# Altium schematic sheet CLRC66302HN, 151.SchDoc
size A; SheetNumber: 3; SheetTotal: 10
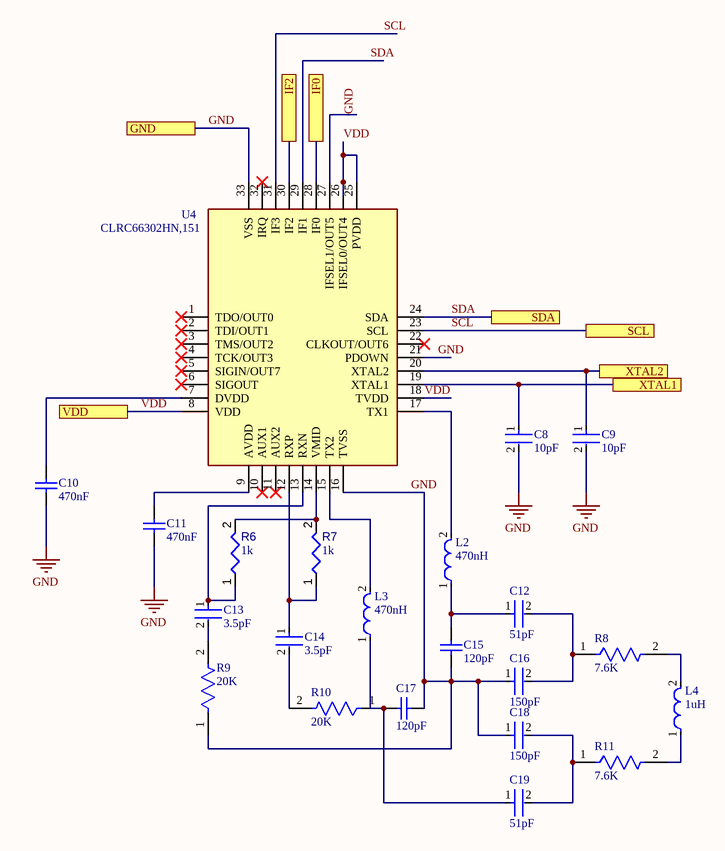
[diagram p0: CLRC66302HN, 151.SchDoc]

## Parts
C8  10pF  [FP-GRM033-0_03-IPC_A]
C9  10pF  [FP-GRM033-0_03-IPC_A]
C10  470nF  [CAPC1005X55X25LL05T10]
C11  470nF  [CAPC1005X55X25LL05T10]
C12  51pF  [FP-GRM033-0_03-IPC_B]
C13  3.5pF  [FP-CL1012-IPC_C]
C14  3.5pF  [FP-CL1012-IPC_C]
C15  120pF  [CAPC1005X55X25ML05T10]
C16  150pF  [FP-GRM033-0_03-MFG]
C17  120pF  [CAPC1005X55X25ML05T10]
C18  150pF  [FP-GRM033-0_03-MFG]
C19  51pF  [FP-GRM033-0_03-IPC_B]
L2  470nH  [FP-MLZ1005-MFG]
L3  470nH  [FP-MLZ1005-MFG]
L4  1uH  [FP-MLP1005D-MFG]
R6  value 1k  [RESC0402(1005)_L]  (hidden comment: 1KR2J)
R7  value 1k  [RESC0402(1005)_L]  (hidden comment: 1KR2J)
R8  7.6K  [FP-AC0402-IPC_B]
R9  20K  [FP-ERJ2RK-MFG]
R10  20K  [FP-ERJ2RK-MFG]
R11  7.6K  [FP-AC0402-IPC_B]
U4  CLRC66302HN,151  [QFN50P500X500X100-33N-D]

## Ports
GND (see mainsheet[1B], MAXREFDES117[2C], temp[2B]), IF0 (see mainsheet[2B]), IF2 (see mainsheet[2B]), SCL (see mainsheet[2A], ESP32-C3-MINI-1U-H4[2C], MAXREFDES117[1B], temp[1B]), SDA (see mainsheet[2A], ESP32-C3-MINI-1U-H4[2C], MAXREFDES117[1B], temp[1B]), VDD (see mainsheet[1B], NHD-1.27-12896UGC3[1B]), XTAL1 (see mainsheet[2B], ESP32-C3-MINI-1U-H4[2B]), XTAL2 (see mainsheet[2B], ESP32-C3-MINI-1U-H4[2B])

## Nets
GND: C8.2 C9.2 C10.1 C11.1 C15.1 C16.1 C17.2 C18.1 R9.1 U4.16(TVSS) U4.21(PDOWN) U4.27(IFSEL1/OUT5) U4.33(VSS) ; port GND
IF0: U4.28(IF0) ; port IF0
IF2: U4.30(IF2) ; port IF2
SCL: U4.23(SCL) U4.31(IF3) ; port SCL
SDA: U4.24(SDA) U4.29(IF1) ; port SDA
VDD: U4.8(VDD) U4.18(TVDD) U4.25(PVDD) U4.26(IFSEL0/OUT4) ; port VDD
XTAL1: C8.1 U4.19(XTAL1) ; port XTAL1
XTAL2: C9.1 U4.20(XTAL2) ; port XTAL2
NetC10_2: C10.2 U4.7(DVDD)
NetC11_2: C11.2 U4.9(AVDD)
NetC12_1: C12.1 C15.2 L2.1
NetC12_2: C12.2 C16.2 R8.1
NetC13_1: C13.1 R6.1 U4.13(RXN)
NetC13_2: C13.2 R9.2
NetC14_1: C14.1 R7.1 U4.12(RXP)
NetC14_2: C14.2 R10.2
NetC17_1: C17.1 C19.1 L3.1 R10.1
NetC18_2: C18.2 C19.2 R11.1
NetL2_2: L2.2 U4.17(TX1)
NetL3_2: L3.2 U4.15(TX2)
NetL4_1: L4.1 R11.2
NetL4_2: L4.2 R8.2
NetR6_2: R6.2 R7.2 U4.14(VMID)

Not connected (* = marked no-connect by the designer): U4 1(TDO/OUT0)* 2(TDI/OUT1)* 3(TMS/OUT2)* 4(TCK/OUT3)* 5(SIGIN/OUT7)* 6(SIGOUT)* 10(AUX1)* 11(AUX2)* 22(CLKOUT/OUT6)* 32(IRQ)*

## Library data of the parts
C8 C9 = CMP-2010-01302-2: Chip Multilayer Ceramic Capacitors for General Purpose, 0201, 10pF, C0G, 30ppm/°C, 5%, 25V; Length: 0.024inch; Voltage Rating: 25V; Packaging: Tape and Reel; Max Operating Temperature: 125°C; Mount: Surface Mount; Capacitance: 10pF; Tolerance: 5%; Series: GRM; Case Code (Metric): 0603; Package Quantity: 1; Voltage Rating (DC): 25V; Depth: 0.3mm; Min Operating Temperature: -55°C; Width: 0.012inch; Thickness: 0.013inch; Termination: SMD/SMT; Lead Free: Lead Free; Case/Package: 0201; Case Code (Imperial): 0201; Dielectric: C0G; REACH SVHC: No SVHC
C10 C11 = CMP-2008-04548-1: Manufacturer: Murata; Part Number: GRM155R60J474KE19D
C12 C19 = CMP-2010-01140-2: Chip Multilayer Ceramic Capacitors for General Purpose, 0201, 51pF, C0G, 30ppm/°C, 2%, 50V; Packaging: Tape and Reel; Case Code (Metric): 0603; Tolerance: 2%; Case/Package: 0201; Width: 0.012inch; Voltage Rating: 50V; Min Operating Temperature: -55°C; Mount: Surface Mount; Package Quantity: 15000; Case Code (Imperial): 0201; Length: 0.024inch; Thickness: 0.013inch; Capacitance: 51pF; Voltage Rating (DC): 50V; Termination: SMD/SMT; Max Operating Temperature: 125°C
C13 C14 = CMP-13271-003043-1: Cap Ceramic 3.5pF 50V C0G ±0.25pF SMD 0402 +125°C Paper T/R; Width: 0.02inch; Depth: 0.5mm; Packaging: Tape and Reel; Case Code (Metric): 1005; Radiation Hardening: No; Max Operating Temperature: 125°C; Case Code (Imperial): 0402; Min Operating Temperature: -55°C; Case/Package: 0402; Voltage Rating (DC): 50V; Package Quantity: 1; Dielectric: C0G; Capacitance: 3.5pF; Voltage Rating: 50V; Length: 0.039inch; Height: 0.5mm; Thickness: 0.022inch; Mount: Surface Mount
C15 C17 = CMP-2008-03922-1: Manufacturer: Murata; Part Number: GRM1555C1H121JA01D
C16 C18 = CMP-1033-00511-3: Chip Multilayer Ceramic Capacitors for General Purpose, 0201, 150pF, X7R, 15%, 10%, 25V; Case/Package: 0201; Capacitance: 150pF; Max Operating Temperature: 125°C; Height: 0.3mm; Width: 0.012inch; Lead Free: Lead Free; Case Code (Metric): 0603; Termination: SMD/SMT; Package Quantity: 1; Material: Ceramic; Length: 0.6mm; Voltage Rating: 25V; Case Code (Imperial): 0201; Dielectric: X7R; Number of Pins: 2; Voltage Rating (DC): 25V; Tolerance: 10%; Packaging: Tape and Reel; REACH SVHC: No SVHC; Thickness: 0.013inch; Mount: Surface Mount; Radiation Hardening: No; Min Operating Temperature: -55°C; Depth: 0.3mm
L2 L3 = CMP-08253-000253-1: Shielded Multilayer Inductor 470nH ±20% 500mA 260mΩ SMD 0402; Test Frequency: 2MHz; Self Resonant Frequency: 260MHz; Core Material: Ferrite; DC Resistance (DCR): 260mR; Saturation Current: 120mA; Max Operating Temperature: 125°C; Tolerance: 20%; Inductance: 470nH; Min Operating Temperature: -55°C; Length: 0.039inch; Mount: Surface Mount; Case Code (Imperial): 0402; RoHS Compliant: Yes; Shielding: Shielded; Case/Package: 0402; Width: 0.02inch; Case Code (Metric): 1005; Height - Seated (Max): 0.022inch; Package Quantity: 10000; Current Rating: 500mA; Packaging: Tape and Reel
L4 = CMP-08253-000043-1: FIXED IND 1UH 500MA 689 MOHM SMD; Test Frequency: 10MHz; Shielding: Shielded; DC Resistance (DCR): 689mR; Tolerance: 20%; Core Material: Ferrite; Case/Package: 0402; Packaging: Tape and Reel; Height - Seated (Max): 0.03inch; Termination: SMD/SMT; Weight: 2.3E-05oz; Mount: Surface Mount; Height: 0.75mm; RoHS Compliant: Yes; Max DC Current: 500mA; Case Code (Metric): 1005; Width: 0.02inch; Current Rating: 500mA; Length: 0.039inch; Package Quantity: 8000; Case Code (Imperial): 0402; Max Operating Temperature: 125°C; Min Operating Temperature: -40°C; Inductance: 1uH
R6 R7 = CMP-009-00075-2: 1K 0.063W 5% 0402 (1005 Metric)  SMD; Power: 63mW; Pins: 2; Mounting Technology: SMT; Case/Package: 0402; Tolerance: 5%
R8 R11 = CMP-03412-020412-3: RES 7.68kΩ ±1% 0.063W 0402; Max Power Dissipation: 63mW; Power Rating: 62.5mW; Resistance: 7.68kR; Temperature Coefficient: 100ppm/°C; Voltage Rating: 50V; Min Operating Temperature: -55°C; Number of Terminations: 2; RoHS Compliant: Yes; Max Operating Temperature: 155°C; Packaging: Tape and Reel; Length: 0.039inch; Width: 0.5mm; Series: AC; Tolerance: 1%; Case Code (Metric): 1005; Case/Package: 0402; Features: Moisture Resistant; Height: 0.015inch; Case Code (Imperial): 0402; Resistor Type: Thick Film; Termination: SMD/SMT; Ratings: AEC-Q200
R9 R10 = CMP-2002-00759-4: RES SMD 20K OHM 1% 1/10W 0402; Resistance: 20kR; Voltage Rating (DC): 50V; Power Rating: 100mW; Temperature Coefficient: 100ppm/°C; Radiation Hardening: No; Case/Package: 0402; Case Code (Metric): 1005; Min Operating Temperature: -55°C; Termination: SMD/SMT; Package Quantity: 1; Length: 1mm; Case Code (Imperial): 0402; Lead Free: Lead Free; Height: 0.35mm; Max Operating Temperature: 155°C; Depth: 0.5mm; Number of Terminations: 2; Military Standard: Not; Max Power Dissipation: 100mW; Tolerance: 1%; Composition: Thick Film; Weight: 2.8E-05oz; Features: Automotive AEC-Q200; Voltage Rating: 50V; Contact Plating: Tin; REACH SVHC: No SVHC; Width: 0.02inch; Packaging: Cut Tape; Mount: Surface Mount
U4 = CLRC66302HN,151: Integrated Circuit; Manufacturer_Name: NXP; Datasheet Link: https://www.nxp.com/docs/en/data-sheet/CLRC663.pdf; Height: 1mm; Manufacturer_Part_Number: CLRC66302HN,151; Mouser Part Number: 771-CLRC66302HN151; Mouser Price/Stock: https://www.mouser.co.uk/ProductDetail/NXP-Semiconductors/CLRC66302HN151?qs=5J1PErz%2F79mfg%2FHQR3Mbhw%3D%3D; Arrow Part Number: CLRC66302HN,151; Arrow Price/Stock: https://www.arrow.com/en/products/clrc66302hn151/nxp-semiconductors?region=nac